# EAGLE design IR (EAGLE 9.6.2)
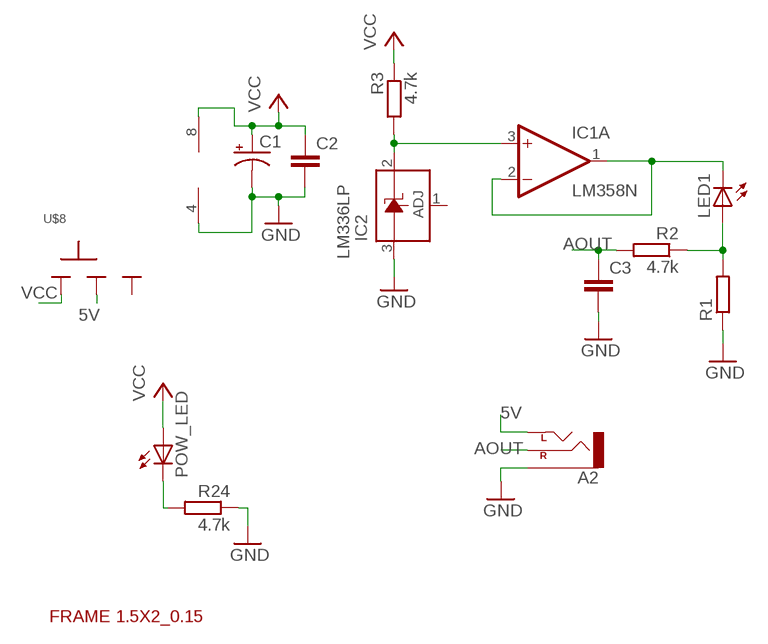
[diagram p0: schematic, sheet 1]

## Parts
A2  AUX-CONNECTOR_CEDT_JANUARY_2015_V5_AUDIO-JACKPTH  [AUX-CONNECTOR_CEDT_JANUARY_2015_V5_AUDIO-JACK]
C1  CAP_POL  [E2,5-5-10U]
C2  C-EU025-024X044  [C025-024X044]
C3  C-EU025-024X044  [C025-024X044]
IC1  LM358N  [DIL08]
IC2  LM336LP  [TO92]
LED1  LED5MM  [LED5MM]
POW_LED  LED3MM  [LED3MM]
R1  R-EU_0204/7  [0204/7]
R2  4.7k  R-EU_0204/7  [0204/7]
R3  4.7k  R-EU_0204/7  [0204/7]
R24  4.7k  R-EU_0204/7  [0204/7]
U$1  FRAME_1.5X2_RAD_0.15  [FRAME_1.5X2_RAD_0.15]
U$8  SLIDESWITCH-BIG  [BIGSWITCH]

## Nets
5V: A2.TIP(LEFT) U$8.2
AOUT: A2.RING(RIGHT) C3.1 R2.2
GND: A2.SLEEVE C1.- C2.2 C3.2 IC1.4(P:V-) IC2.3(A) R1.1 R24.1
N$1: IC1.3(A:+IN) IC2.2(C) R3.2
N$2: LED1.A R1.2 R2.1
N$3: IC1.1(A:OUT) IC1.2(A:-IN) LED1.K(C)
N$8: POW_LED.K(C) R24.2
VCC: C1.+ C2.1 IC1.8(P:V+) POW_LED.A R3.1 U$8.1
Unconnected: IC1.5(B:+IN) IC1.6(B:-IN) IC1.7(B:OUT) IC2.1(ADJ) U$8.3

## Library data of the parts
A2 = aux-connector:AUX-CONNECTOR_CEDT_JANUARY_2015_V5_AUDIO-JACK: 3.5mm Audio Jack Simple 3.5mm common PCB mount audio jack. SKU: PRT-08032
C1 = CEDT_2022_v4:CAP_POL
C2 C3 = rcl:C-EU: CAPACITOR, European symbol; SPICEPREFIX: C
IC1 = CEDT_2022_v4:LM358: OP AMP also LM158; LM258; LM2904 Source: http://cache.national.com/ds/LM/LM158.pdf
IC2 = linear:LM336: 2.5-V INTEGRATED REFERENCE CIRCUITS LM236 Source: http://focus.ti.com/lit/ds/symlink/lm336-2.5.pdf
LED1 POW_LED = CEDT_JANUARY_2015_v6:LED
R1 = resistor:R-EU_: RESISTOR, European symbol
R2 R3 R24 = rcl:R-EU_: RESISTOR, European symbol; SPICEPREFIX: R
U$1 = CEDT_JANUARY_2015_v6:FRAME_1.5X2_RAD_0.15
U$8 = CEDT_JANUARY_2015_v6:SLIDESWITCH

## Board
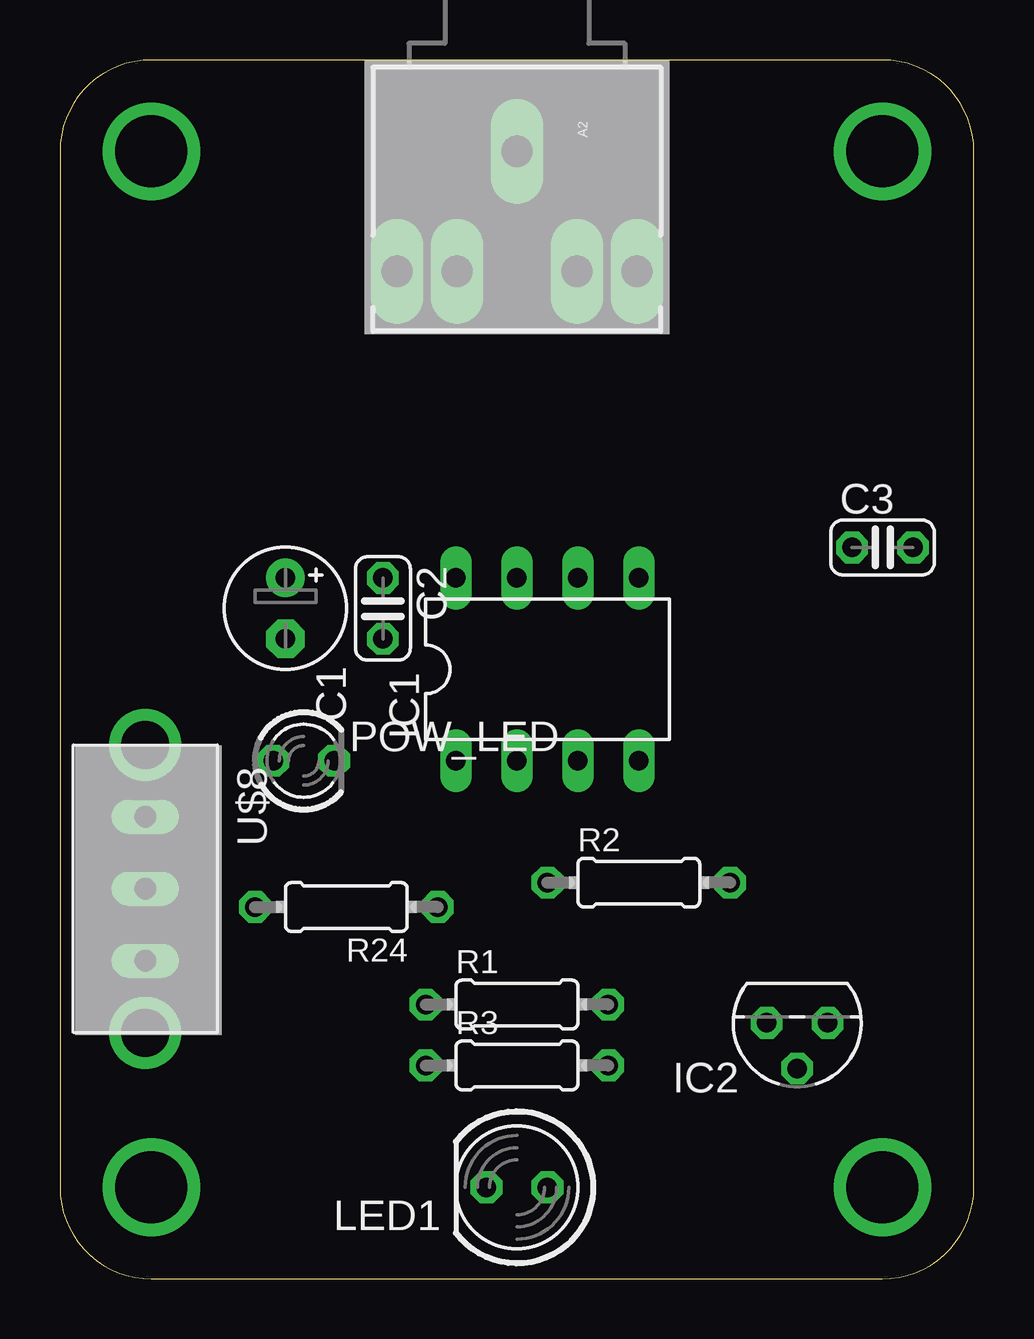
[diagram p1: board, top side]
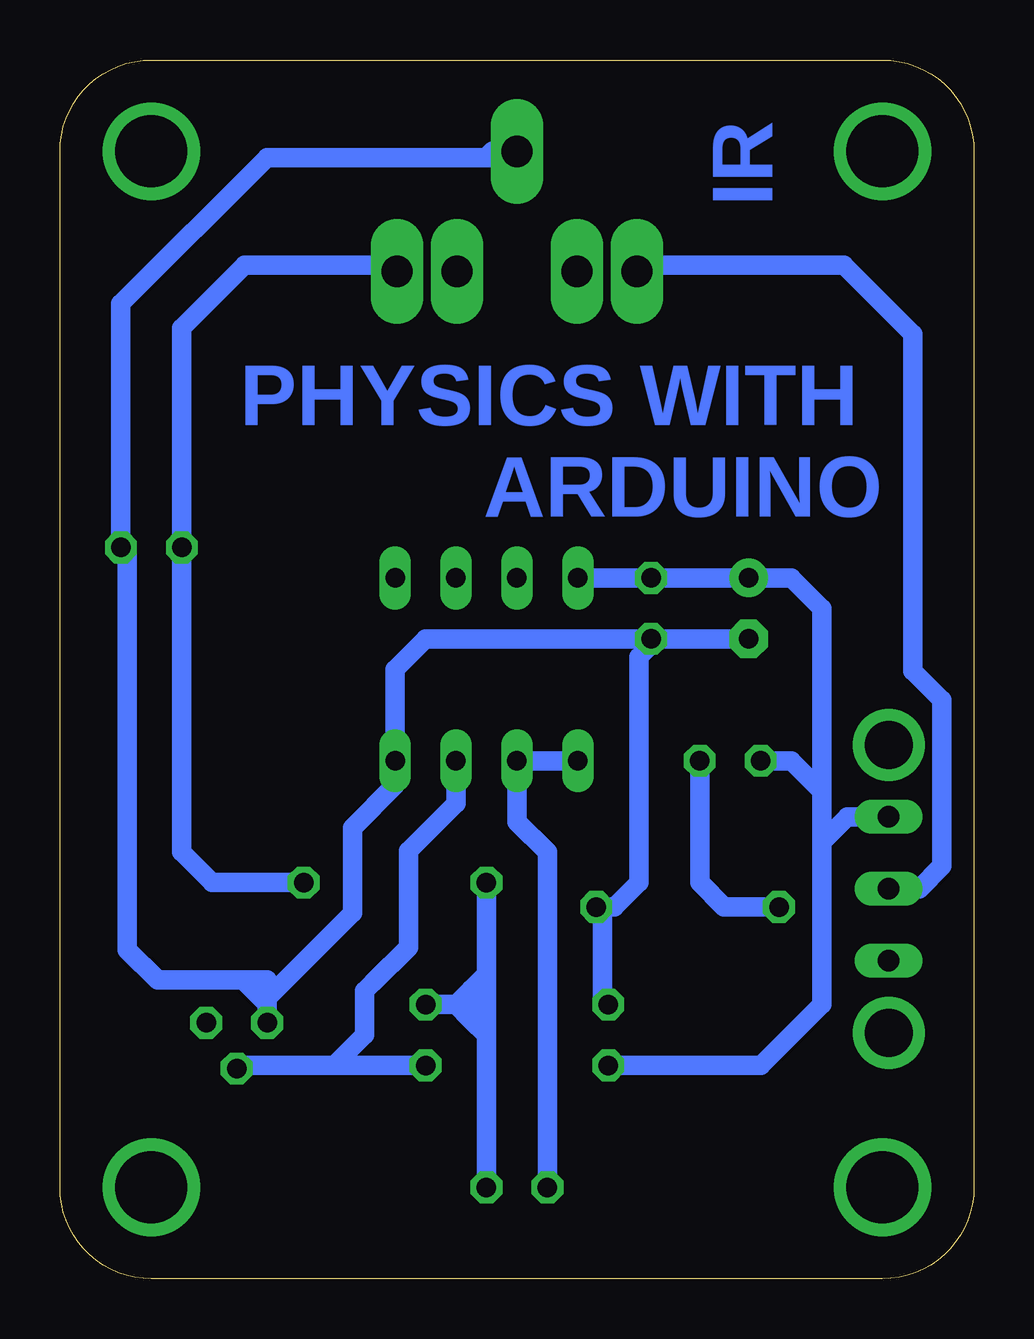
[diagram p2: board, bottom side, seen from below]

Size 38.1 x 50.8 mm. Coordinates in mm from the lower left corner, seen from the top.
Copper layers (1*16): Top 0.035mm / dielectric 1.5mm / Bottom 0.035mm
Design rules "default *": minimum track width 6mil, minimum drill 0.35mm, track to track 16mil, track to pad 16mil, pad to pad 16mil, via to via 16mil, smd to smd 16mil, copper to edge 40mil, drill to drill 6mil, minimum pad ring 10mil, minimum via ring 8mil, stop-mask expansion 4mil, vias tented up to drill 0mil, thermal gap 10mil

### Footprints (pad centres in the part's own frame; a part is rotated, then mirrored left to right if it is on the bottom)
AUX-CONNECTOR_CEDT_JANUARY_2015_V5_AUDIO-JACK = drill 1.3 pad 2.184 long: RING 5,5; RSH 5,2.5; SLEEVE 0,0; TIP 5,-5; TSH 5,-2.5
E2,5-5-10U = drill 0.813 pad 1.6: + -1.27,0 | drill 0.813 pad 1.6 octagon: - 1.27,0
C025-024X044 = drill 0.813 octagon: 1 -1.27,0; 2 1.27,0
DIL08 = drill 0.813 long: 1 -3.81,-3.81; 2 -1.27,-3.81; 3 1.27,-3.81; 4 3.81,-3.81; 5 3.81,3.81; 6 1.27,3.81; 7 -1.27,3.81; 8 -3.81,3.81
TO92 = drill 0.813 octagon: 1 -1.27,0; 2 0,1.905; 3 1.27,0
LED5MM = drill 0.813 octagon: A -1.27,0; K 1.27,0
LED3MM = drill 0.813 octagon: A -1.27,0; K 1.27,0
0204/7 = drill 0.813 octagon: 1 -3.81,0; 2 3.81,0
FRAME_1.5X2_RAD_0.15 = drill 2.997 pad 4.064: P$1 3.81,46.99; P$2 34.29,46.99; P$3 34.29,3.81; P$4 3.81,3.81
BIGSWITCH = drill 0.9 long: 1 -3,0; 2 0,0; 3 3,0 | drill 2 pad 2.184: TAB1 -6,0; TAB2 6,0

### Placement (x,y rotation side)
A2  19.05,46.99 270 top
C1  9.4,27.94 270 top
C2  13.46,27.94 270 top
C3  34.29,30.48 0 top
IC1  20.32,25.4 0 top
IC2  30.73,10.67 180 top
LED1  19.05,3.81 180 top
POW_LED  10.16,21.59 0 top
R1  19.05,11.43 0 top
R2  24.13,16.51 0 top
R3  19.05,8.89 0 top
R24  11.94,15.49 180 top
U$1  0,0 0 top
U$8  3.56,16.26 270 top

### Tracks (layer width: path | path; a pad name or v marks a point on that pad's centre or on a via)
5V
  Bottom 0.813: U$8.2 2.29,16.26 1.34,17.2 1.34,24.13 2.54,25.32 2.54,39.37 5.41,42.24 13.8,42.24 A2.TIP
AOUT
  Bottom 0.813: R2.2 31.75,16.51 33.02,17.78 C3.1 33.02,39.62 30.4,42.24 24.3,42.24 A2.RING
GND
  Bottom 0.813: 20.32,46.74 29.46,46.74 35.56,40.64 C3.2 35.31,30.23 35.31,13.72 34.04,12.45 30.48,12.45 | 20.32,46.74 19.05,46.74 | C1.- C2.2 | C2.2 22.86,26.67 24.13,25.4 IC1.4 24.13,20.57 25.91,18.8 25.91,15.24 29.46,11.68 | C2.2 13.46,26.42 13.97,25.91 13.97,16.51 14.99,15.49 R24.1 15.49,15.24 15.49,11.68 R1.1 | 30.48,12.45 29.46,12.45 29.46,11.68 | 29.46,11.68 29.46,11.43 | 29.46,11.43 IC2.3 | 29.46,11.43 30.48,12.45 | A2.SLEEVE 20.07,46.99 20.32,46.74
N$1
  Bottom 0.813: R3.2 26.67,8.89 | 26.67,8.89 28.5,8.89 30.61,8.89 IC2.2 | IC1.3 21.59,19.81 23.57,17.83 23.57,13.82 25.05,12.35 25.4,11.99 25.4,10.16 26.67,8.89
N$2
  Bottom 0.813: LED1.A 20.32,10.16 | 21.59,11.43 20.95,10.79 | 20.95,10.79 20.32,10.16 | 21.59,11.43 R1.2 | 21.59,11.43 20.95,12.06 | 20.95,12.06 20.32,12.7 | 20.32,12.7 R2.1 | 20.32,12.7 20.32,10.16 | 20.95,12.06 20.95,10.79
N$3
  Bottom 0.813: IC1.1 IC1.2 19.05,19.05 17.78,17.78 LED1.K
N$8
  Bottom 0.813: POW_LED.K 11.43,16.51 10.41,15.49 R24.2
VCC
  Bottom 0.813: U$8.1 5.29,19.26 6.35,18.19 | IC1.8 C2.1 C1.+ 7.62,29.21 6.35,27.94 6.35,20.32 | POW_LED.A 7.62,21.59 6.35,20.32 | R3.1 8.89,8.89 6.35,11.43 6.35,17.78 6.35,18.19 | 6.35,18.19 6.35,20.32

### Text on the board
Bottom: IR | PHYSICS WITH / ARDUINO